# EAGLE design ccd_breakout_v1 (EAGLE 9.5.2)
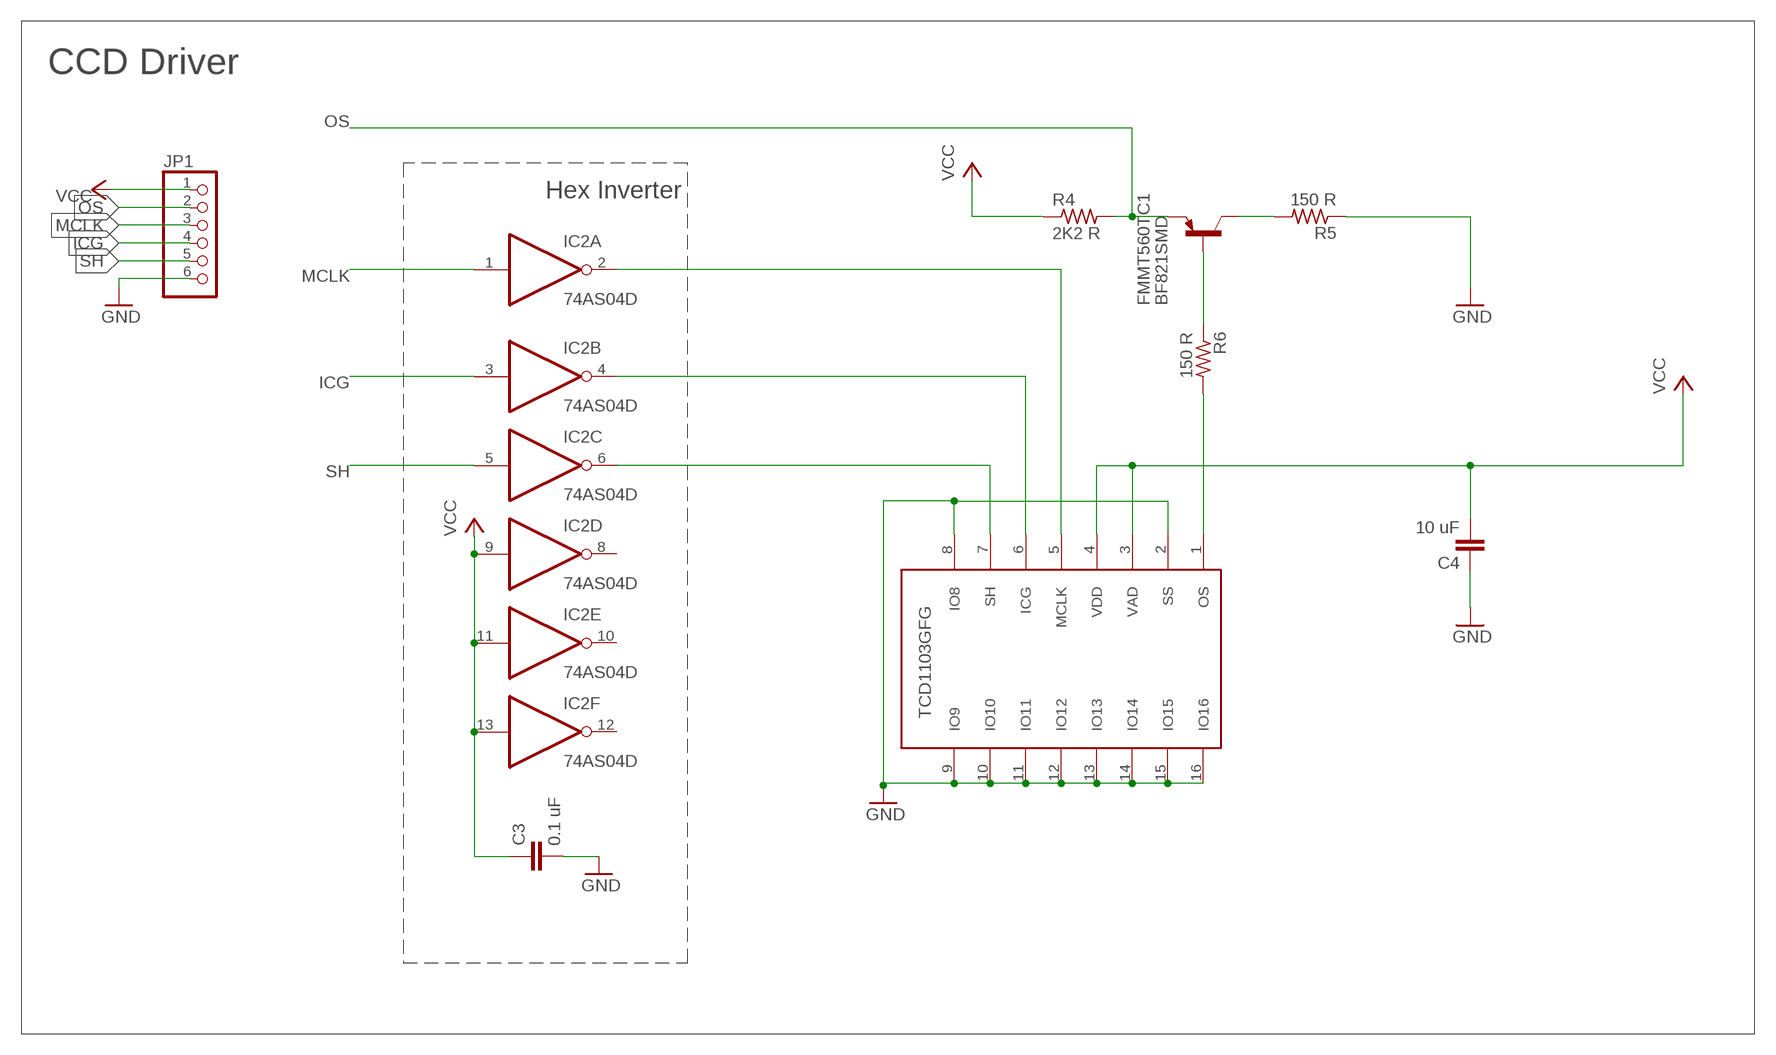
[diagram p0: schematic, sheet 1]

## Parts
C3  0.1 uF  C-EUC1210  [C1210]
C4  10 uF  C-EUC1210  [C1210]
FMMT560TC1  BF821SMD  [SOT23-BEC]
IC2  74AS04D  [SO14]
JP1  PINHD-1X6  [1X06]
R4  2K2 R  R-US_R1206  [R1206]
R5  150 R  R-US_R1206  [R1206]
R6  150 R  R-US_R1206  [R1206]
U$1  TCD1103_TCD1103  [TCD1103_WQFN16X-240B]

## Nets
GND: C3.2 C4.1 JP1.6 R5.1 U$1.2(SS) U$1.8(IO8) U$1.9(IO9) U$1.10(IO10) U$1.11(IO11) U$1.12(IO12) U$1.13(IO13) U$1.14(IO14) U$1.15(IO15) U$1.16(IO16)
ICG: IC2.3(B:I) JP1.4
MCLK: IC2.1(A:I) JP1.3
N$7: FMMT560TC1.C R5.2
N$8: FMMT560TC1.B R6.1
N$9: R6.2 U$1.1(OS)
N$10: IC2.2(A:O) U$1.5(MCLK)
N$11: IC2.4(B:O) U$1.6(ICG)
N$12: IC2.6(C:O) U$1.7(SH)
OS: FMMT560TC1.E JP1.2 R4.2
SH: IC2.5(C:I) JP1.5
VCC: C3.1 C4.2 IC2.9(D:I) IC2.11(E:I) IC2.13(F:I) JP1.1 R4.1 U$1.3(VAD) U$1.4(VDD)
Unconnected: IC2.8(D:O) IC2.10(E:O) IC2.12(F:O)

## Notes on the sheet
- CCD Driver
- Hex Inverter

## Power pins joined to a net without a drawn wire
GND: IC2.7(P:GND)
VCC: IC2.14(P:VCC)

## Library data of the parts
C3 C4 = rcl:C-EU: CAPACITOR, European symbol; SPICEPREFIX: C
FMMT560TC1 = transistor-pnp:BF821*: PNP Transistror
IC2 = 74xx-us:74*04: Hex INVERTER
JP1 = pinhead:PINHD-1X6: PIN HEADER
R4-R6 = rcl:R-US_: RESISTOR, American symbol; SPICEPREFIX: R
U$1 = spectrometer_mother_board_v1:TCD1103_TCD1103

## Board
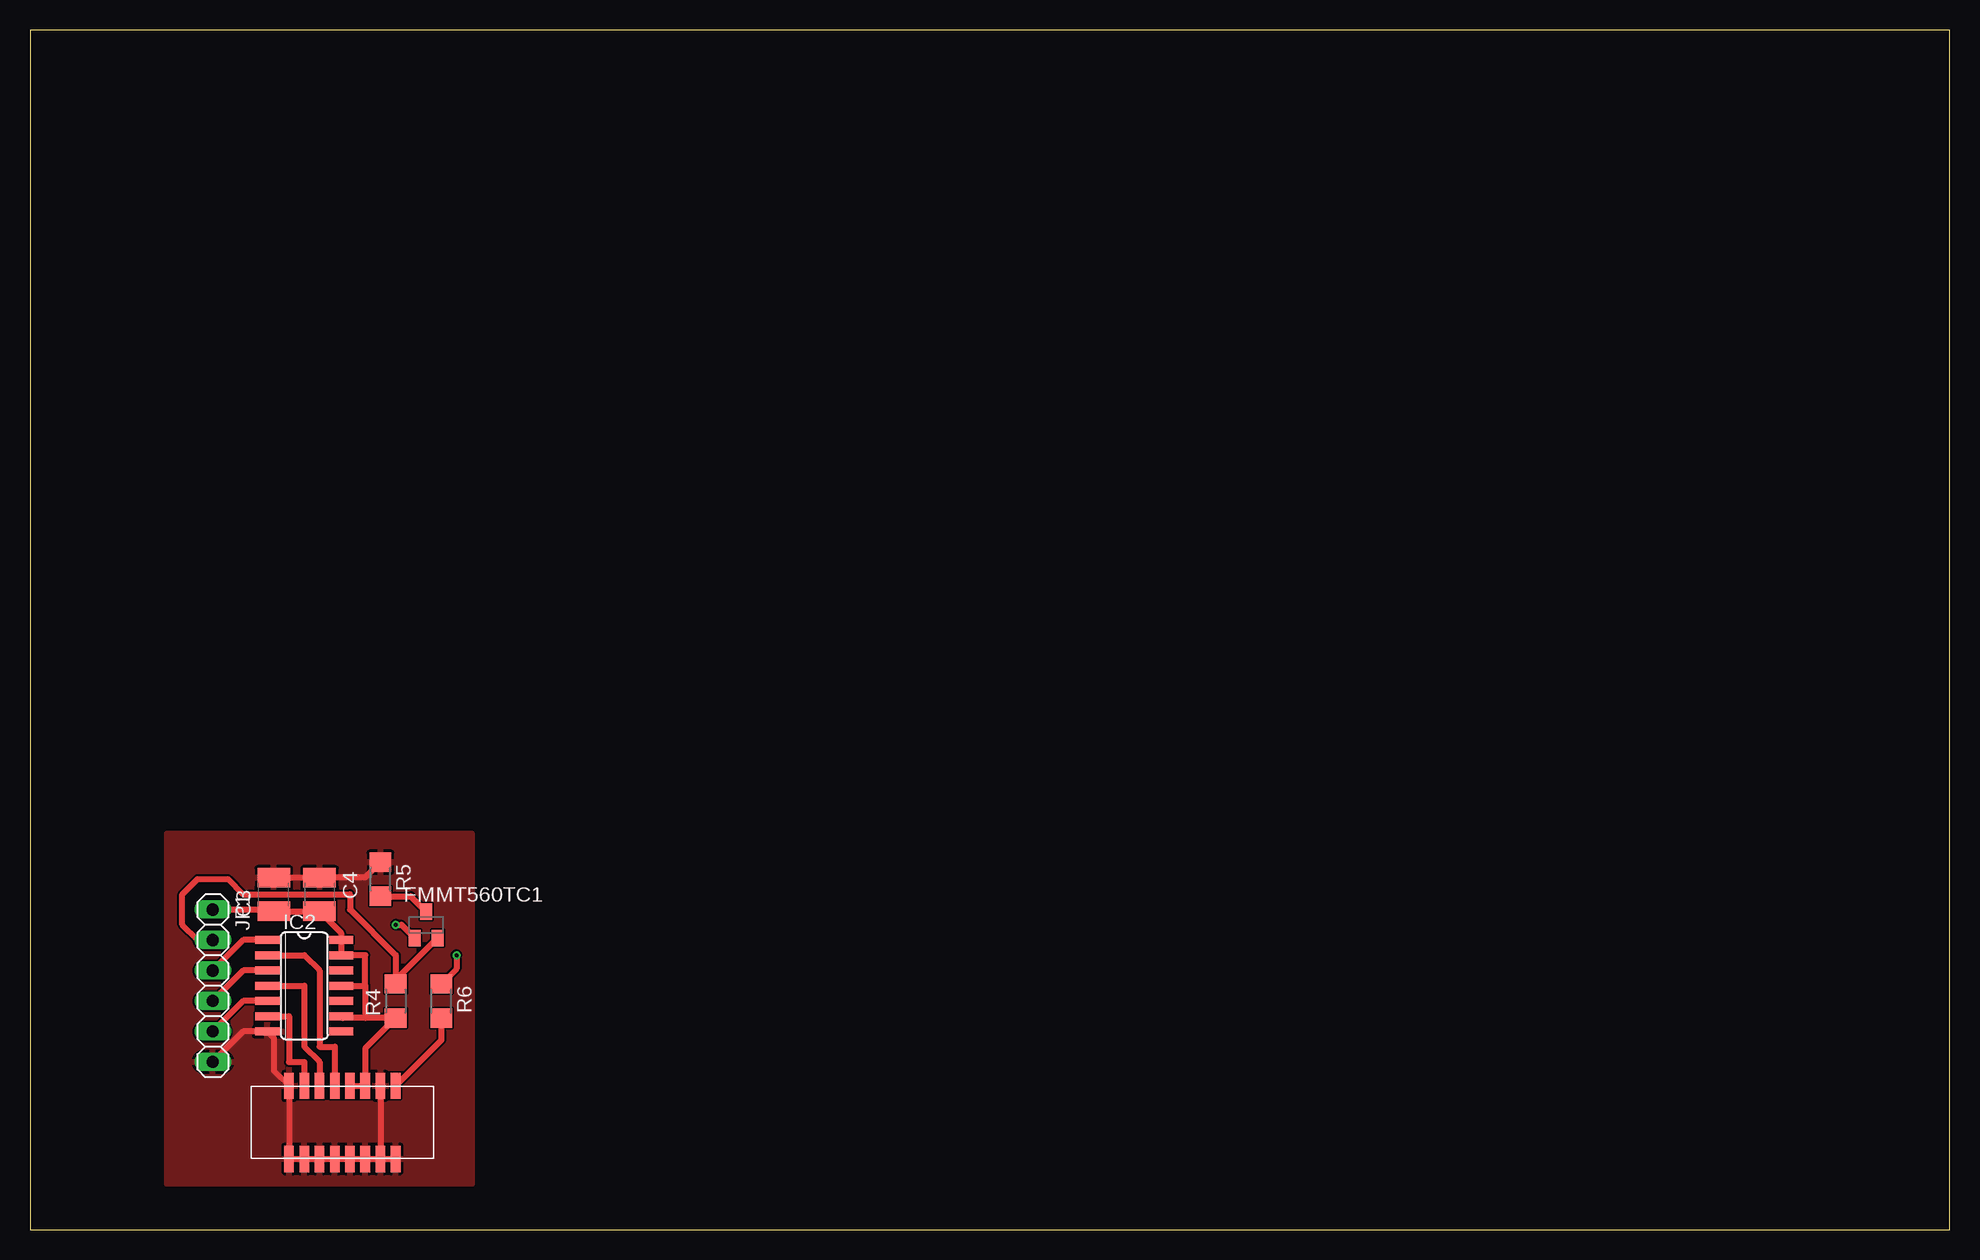
[diagram p1: board, top side]
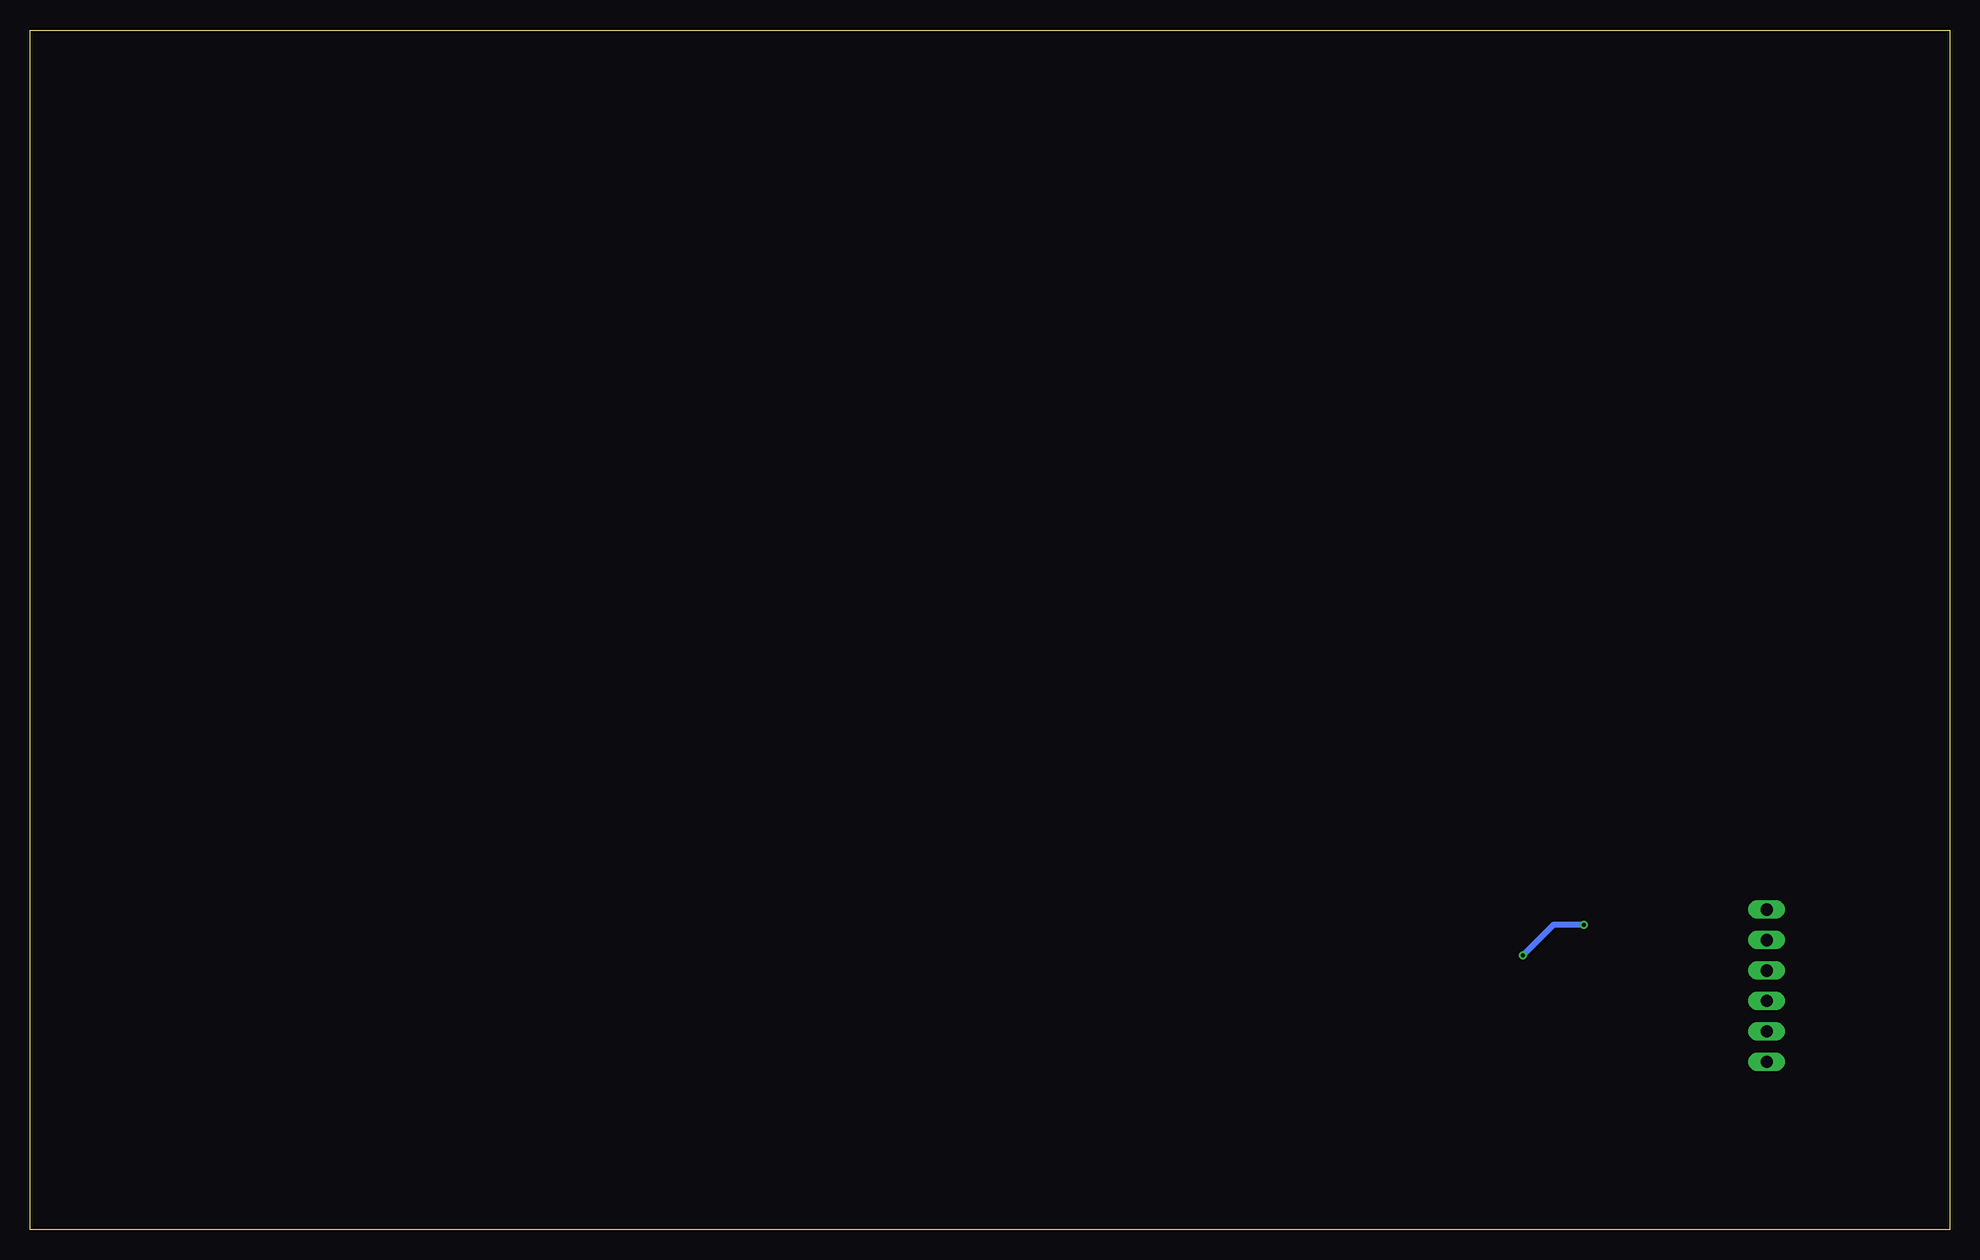
[diagram p2: board, bottom side, seen from below]

Size 160 x 100 mm. Coordinates in mm from the lower left corner, seen from the top.
Outline: 0,0 160,0 160,100 0,100 0,0
Copper layers (1*16): Top 0.035mm / dielectric 1.5mm / Bottom 0.035mm
Design rules "PCBWay_2layer": minimum track width 6mil, minimum drill 0.3mm, track to track 6mil, track to pad 6mil, pad to pad 6mil, via to via 6mil, smd to smd 4mil, copper to edge 10mil, drill to drill 6mil, minimum pad ring 6mil, minimum via ring 6mil, stop-mask expansion 4mil, vias tented up to drill 0.8mm, thermal gap 10mil

### Footprints (pad centres in the part's own frame; a part is rotated, then mirrored left to right if it is on the bottom)
C1210 = smd 1.6 x 2.7: 1 -1.4,0; 2 1.4,0
SOT23-BEC = smd 1 x 1.4: B -0.95,-1.1; C 0,1.1; E 0.95,-1.1
SO14 = smd 0.66 x 2.032: 1 -3.81,-3.073; 2 -2.54,-3.073; 3 -1.27,-3.073; 4 0,-3.073; 5 1.27,-3.073; 6 2.54,-3.073; 7 3.81,-3.073; 8 3.81,3.073; 9 2.54,3.073; 10 1.27,3.073; 11 0,3.073; 12 -1.27,3.073; 13 -2.54,3.073; 14 -3.81,3.073
1X06 = drill 1.016 long: 1 -6.35,0; 2 -3.81,0; 3 -1.27,0; 4 1.27,0; 5 3.81,0; 6 6.35,0
R1206 = smd 1.6 x 1.803: 1 -1.422,0; 2 1.422,0
TCD1103_WQFN16X-240B = smd 2.2 x 0.8: 1 -0.55,8.89; 2 -0.55,7.62; 3 -0.55,6.35; 4 -0.55,5.08; 5 -0.55,3.81; 6 -0.55,2.54; 7 -0.55,1.27; 8 -0.55,0; 9 5.55,8.89; 10 5.55,7.62; 11 5.55,6.35; 12 5.55,5.08; 13 5.55,3.81; 14 5.55,2.54; 15 5.55,1.27; 16 5.55,0

### Placement (x,y rotation side)
C3  20.32,27.94 90 top
C4  24.13,27.94 270 top
FMMT560TC1  33.02,25.4 0 top
IC2  22.86,20.32 270 top
JP1  15.24,20.32 270 top
R4  30.48,19.05 90 top
R5  29.21,29.21 270 top
R6  34.29,19.05 270 top
U$1  21.59,11.43 270 top

### Tracks (layer width: path | path; a pad name or v marks a point on that pad's centre or on a via)
GND
  Top 0.508: JP1.6 17.78,16.51 IC2.7 20.32,15.98 20.32,13.25 U$1.8 U$1.16 U$1.9 | U$1.2 U$1.10 | R5.1 27.92,29.34 C4.1 C3.2
  pour Top: 11.43,33.02 36.83,33.02 36.83,3.81 11.43,3.81
ICG
  Top 0.508: IC2.3 17.78,21.59 JP1.4
MCLK
  Top 0.508: IC2.1 17.78,24.13 JP1.3
N$7
  Top 0.508: R5.2 31.73,27.79 FMMT560TC1.C
N$8  (via drill 0.35)
  Top 0.508: v35.56,22.86 35.56,21.74 R6.1 | v30.48,25.4 30.97,25.4 FMMT560TC1.B
  Bottom 0.508: v30.48,25.4 33.02,25.4 v35.56,22.86
N$9
  Top 0.508: R6.2 34.29,15.79 U$1.1
N$10
  Top 0.508: IC2.2 22.86,22.86 24.13,21.59 24.13,15.24 25.4,15.24 U$1.5
N$11
  Top 0.508: IC2.4 22.86,20.32 22.86,15.24 24.13,13.97 U$1.6
N$12
  Top 0.508: IC2.6 21.59,17.78 21.59,13.97 22.86,13.97 U$1.7
OS
  Top 0.508: FMMT560TC1.E 30.48,20.81 R4.2 30.48,22.86 26.67,26.67 26.67,27.94 17.78,27.94 16.51,29.21 13.97,29.21 12.7,27.94 12.7,25.4 13.97,24.13 JP1.2
SH
  Top 0.508: IC2.5 17.78,19.05 JP1.5
VCC
  Top 0.508: U$1.4 U$1.3 27.94,15.09 R4.1 27.94,17.63 | 27.94,17.63 26.09,17.63 IC2.9 | IC2.11 27.94,20.32 | 27.94,20.32 27.94,17.63 | 27.94,20.32 27.94,22.86 IC2.13 IC2.14 25.93,24.74 C4.2 C3.1 20.19,26.67 JP1.1